# EAGLE design DOT-TEMPLATE (EAGLE 7.2.0)
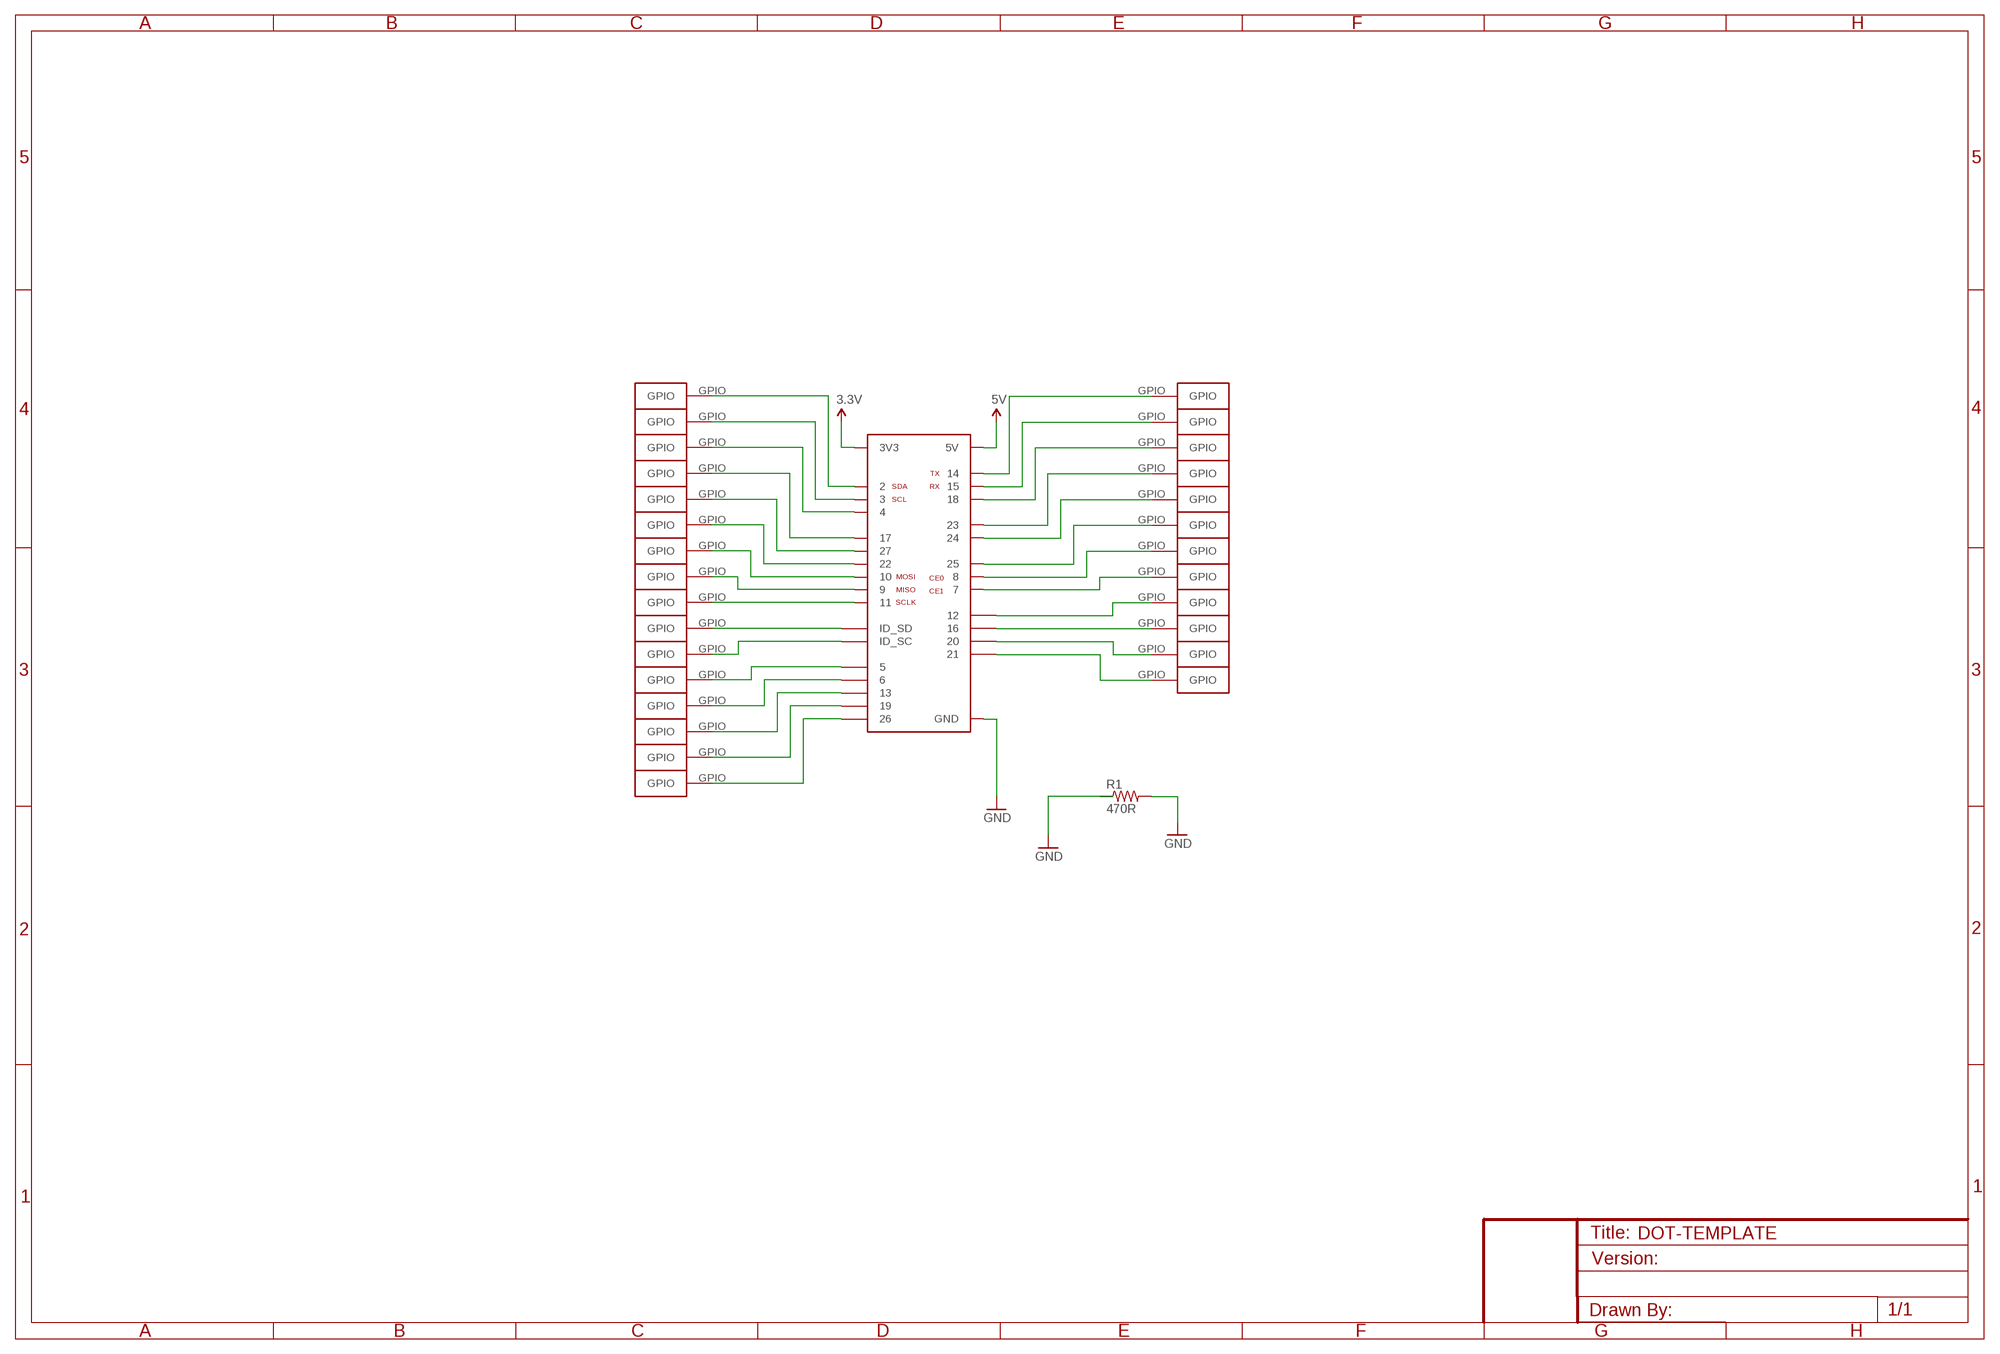
[diagram p0: schematic, sheet 1]

## Parts
AIR  DOT  [DOTPAD]
AIR1  DOT  [DOTPAD]
AIR2  DOT  [DOTPAD]
AIR3  DOT  [DOTPAD]
AIR4  DOT  [DOTPAD]
AIR5  DOT  [DOTPAD]
AIR6  DOT  [DOTPAD]
AIR7  DOT  [DOTPAD]
AIR8  DOT  [DOTPAD]
AIR9  DOT  [DOTPAD]
AIR10  DOT  [DOTPAD]
AIR11  DOT  [DOTPAD]
AIR12  DOT  [DOTPAD]
AIR13  DOT  [DOTPAD]
AIR14  DOT  [DOTPAD]
AIR15  DOT  [DOTPAD]
AIR16  DOT  [DOTPAD]
AIR17  DOT  [DOTPAD]
AIR18  DOT  [DOTPAD]
AIR19  DOT  [DOTPAD]
AIR20  DOT  [DOTPAD]
AIR21  DOT  [DOTPAD]
AIR22  DOT  [DOTPAD]
AIR23  DOT  [DOTPAD]
AIR24  DOT  [DOTPAD]
AIR25  DOT  [DOTPAD]
AIR26  DOT  [DOTPAD]
AIR27  DOT  [DOTPAD]
R1  470R  RESISTOR0603-RES  [0603-RES]
U$1  RPIGPIOPINHD-2X20-SMD-FLIPPED  [FCI_89898_313LF_40P_CONNECTOR_SMT_FLIPPED]

## Nets
3.3V: U$1.P1_3V3(3V3) U$1.P17_3V3(3V3)
5V: U$1.P2_5V(5V) U$1.P4_5V(5V)
GND: R1.2 U$1.P6_GND(GND) U$1.P9_GND(GND) U$1.P14_GND(GND) U$1.P20_GND(GND) U$1.P25_GND(GND) U$1.P30_GND(GND) U$1.P34_GND(GND) U$1.P39_GND(GND)
N$1: AIR10.GPIO U$1.P3_GPIO2_SDA
N$2: AIR9.GPIO U$1.P5_GPIO3_SCL
N$4: AIR.GPIO U$1.P7_GPIO4
N$5: AIR1.GPIO U$1.P11_GPIO17
N$6: AIR2.GPIO U$1.P13_GPIO27
N$7: AIR3.GPIO U$1.P15_GPIO22
N$8: AIR4.GPIO U$1.P19_GPIO10_SPI0_MOSI
N$9: AIR5.GPIO U$1.P21_GPIO9_SPI0_MISO
N$10: AIR6.GPIO U$1.P23_GPIO11_SPI0_SCLK
N$11: AIR7.GPIO U$1.P27_IDSD(ID_SD)
N$12: AIR8.GPIO U$1.P28_IDSC(ID_SC)
N$13: AIR11.GPIO U$1.P29_GPIO5
N$14: AIR12.GPIO U$1.P31_GPIO6
N$15: AIR13.GPIO U$1.P33_GPIO13
N$16: AIR14.GPIO U$1.P35_GPIO19
N$17: AIR18.GPIO U$1.P8_GPIO14_UART0_TXD
N$18: AIR15.GPIO U$1.P37_GPIO26
N$19: AIR16.GPIO U$1.P10_GPIO15_UART0_RXD
N$20: AIR17.GPIO U$1.P12_GPIO18
N$21: AIR19.GPIO U$1.P16_GPIO23
N$22: AIR20.GPIO U$1.P18_GPIO24
N$23: AIR21.GPIO U$1.P22_GPIO25
N$24: AIR22.GPIO U$1.P24_GPIO8_SPI0_CE0
N$25: AIR23.GPIO U$1.P26_GPIO7_SPI0_CE1
N$26: AIR24.GPIO U$1.P32_GPIO12
N$27: AIR25.GPIO U$1.P36_GPIO16
N$28: AIR26.GPIO U$1.P38_GPIO20
N$29: AIR27.GPIO U$1.P40_GPIO21
Unconnected: R1.1

## Library data of the parts
AIR AIR1-AIR27 = rzrzr:DOT
R1 = SparkFun-Passives:RESISTOR: Resistor Basic schematic elements and footprints for 0603, 1206, and PTH resistors.
U$1 = pimoroni:RPIGPIOPINHD-2X20-SMD-FLIPPED

## Net classes
0 default: width 0.152 mm, drill 0.5 mm, clearance 0.152 mm

## Board
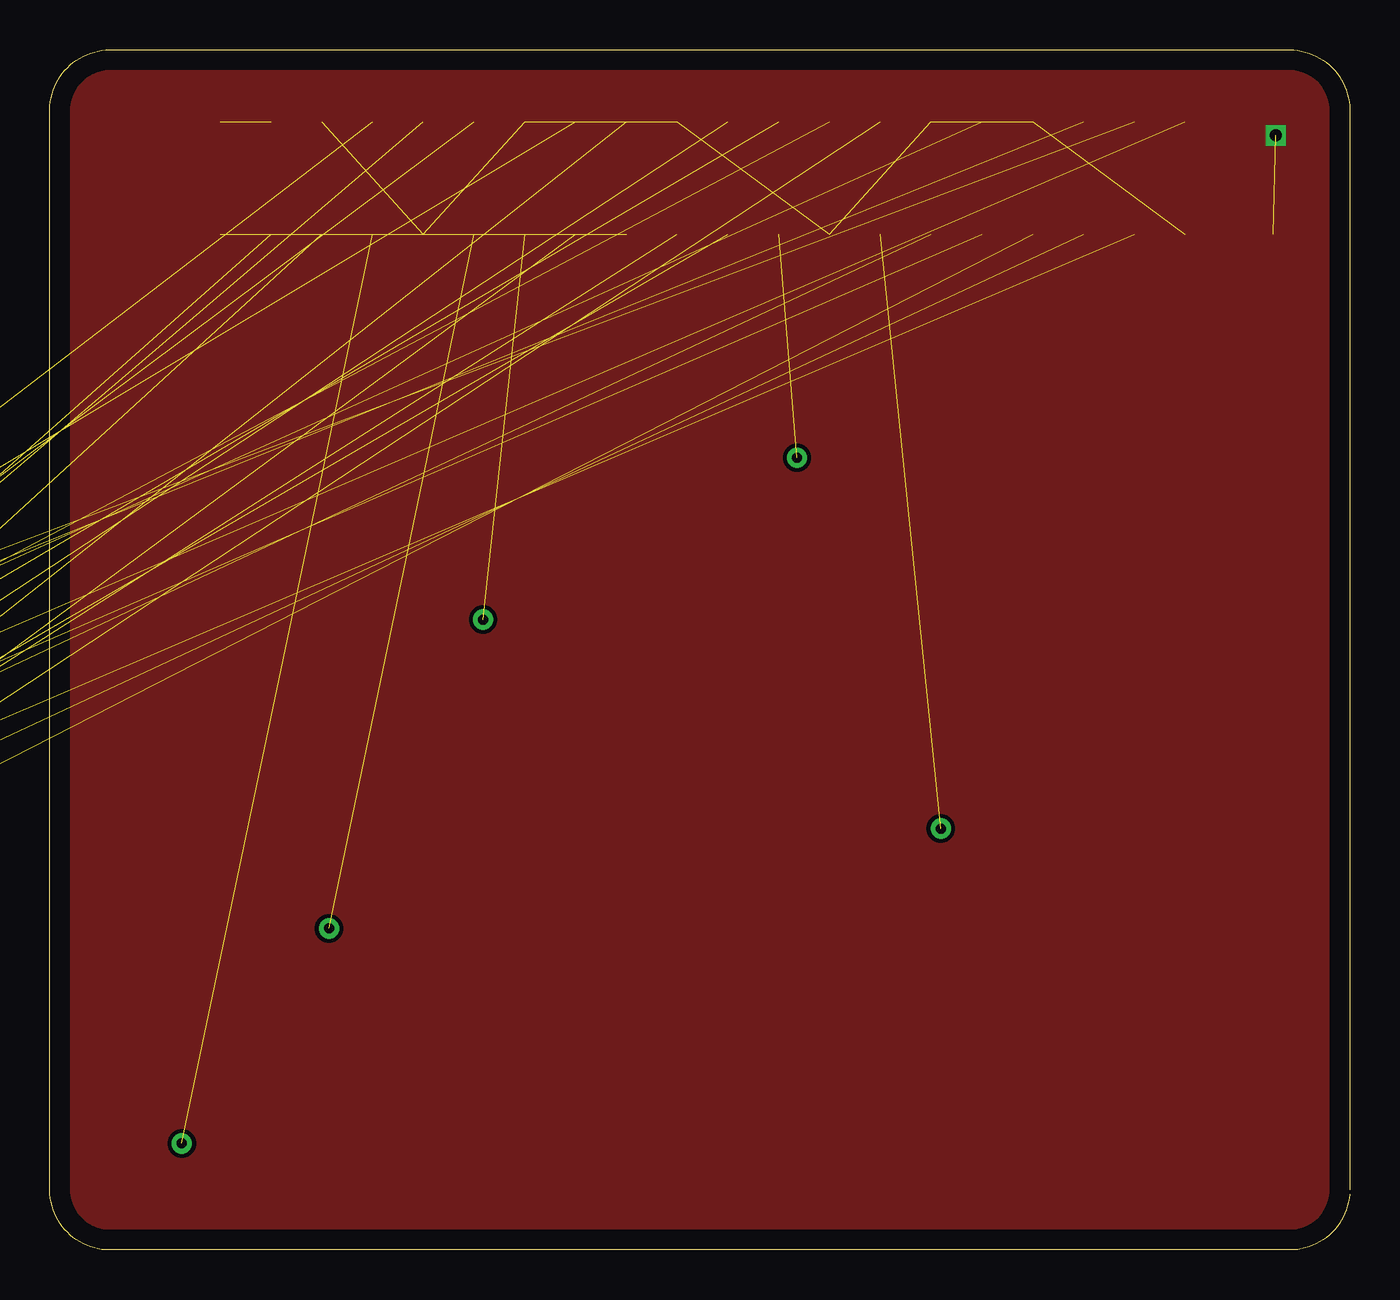
[diagram p1: board, top side]
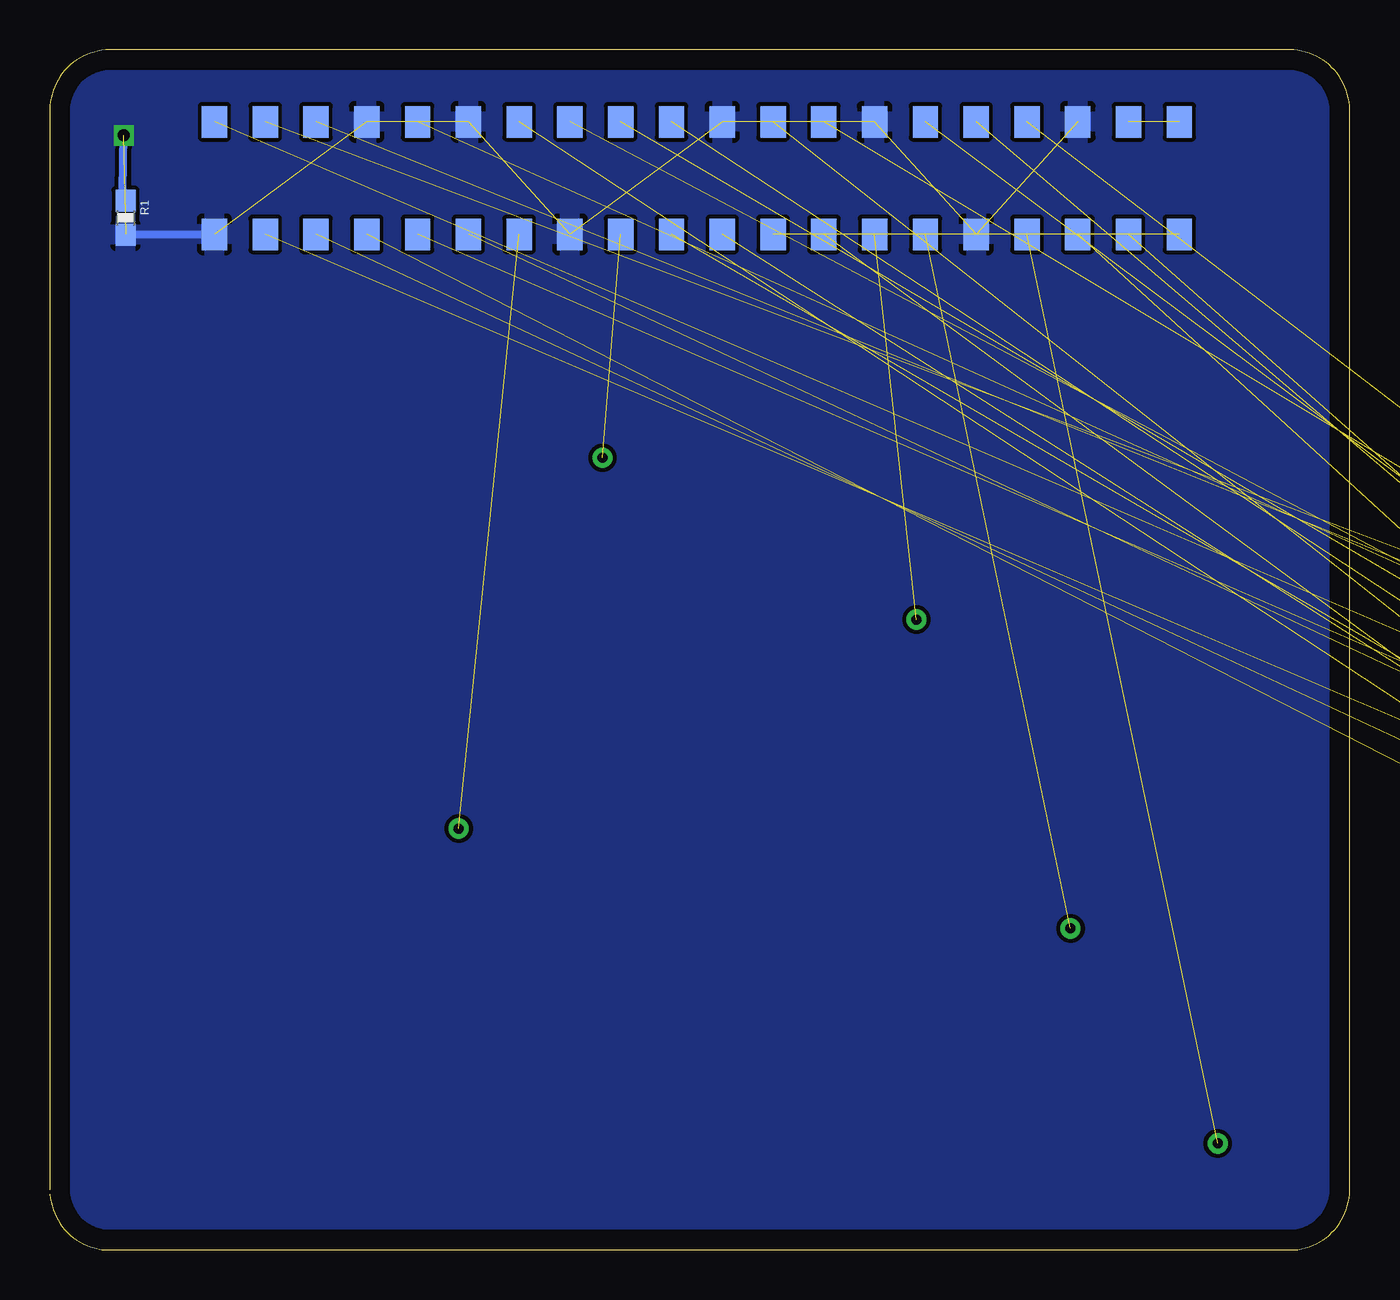
[diagram p2: board, bottom side, seen from below]

Size 65 x 60 mm. Coordinates in mm from the lower left corner, seen from the top.
Outline: 65,2.79 64.98,2.59 64.94,2.4 64.9,2.2 64.84,2.01 64.76,1.83 64.69,1.65 64.6,1.48 64.49,1.32 64.38,1.16 64.26,1.01 63.99,0.74 63.84,0.62 63.68,0.51 63.52,0.4 63.35,0.31 63.17,0.24 62.99,0.16 62.8,0.1 62.41,0.02 62.21,0 2.79,0 2.59,0.02 2.4,0.06 2.2,0.1 2.01,0.16 1.83,0.24 1.65,0.31 1.48,0.4 1.32,0.51 1.16,0.62 1.01,0.74 0.88,0.88 0.74,1.01 0.62,1.16 0.51,1.32 0.4,1.48 0.31,1.65 0.24,1.83 0.16,2.01 0.1,2.2 0.06,2.4 0.02,2.59 0,2.79 0,57.21 0.02,57.41 0.06,57.6 0.1,57.8 0.16,57.99 0.24,58.17 0.31,58.35 0.4,58.52 0.51,58.68 0.62,58.84 0.74,58.99 0.88,59.12 1.01,59.26 1.16,59.38 1.32,59.49 1.48,59.6 1.65,59.69 1.83,59.76 2.01,59.84 2.2,59.9 2.4,59.94 2.59,59.98 2.79,60 62.21,60 62.41,59.98 62.6,59.94 62.8,59.9 62.99,59.84 63.17,59.76 63.35,59.69 63.52,59.6 63.68,59.49 63.84,59.38 63.99,59.26 64.26,58.99 64.38,58.84 64.49,58.68 64.6,58.52 64.69,58.35 64.76,58.17 64.84,57.99 64.9,57.8 64.94,57.6 64.98,57.41 65,57.21 65,3
Copper layers (1*16): Top 0.035mm / dielectric 1.5mm / Bottom 0.035mm
Design rules "default": minimum track width 10mil, minimum drill 24mil, track to track 8mil, track to pad 8mil, pad to pad 8mil, via to via 8mil, smd to smd 8mil, copper to edge 40mil, drill to drill 8mil, minimum pad ring 10mil, minimum via ring 8mil, stop-mask expansion 4mil, vias tented up to drill 0mil, thermal gap 10mil

### Footprints (pad centres in the part's own frame; a part is rotated, then mirrored left to right if it is on the bottom)
DOTPAD = drill 0.5: GPIO 0,0
0603-RES = smd 1.1 x 1: 1 -0.85,0; 2 0.85,0
FCI_89898_313LF_40P_CONNECTOR_SMT_FLIPPED = smd 1.27 x 1.57: P1_3V3 24.13,-2.81; P2_5V 24.13,2.81; P3_GPIO2_SDA 21.59,-2.81; P4_5V 21.59,2.81; P5_GPIO3_SCL 19.05,-2.81; P6_GND 19.05,2.81; P7_GPIO4 16.51,-2.81; P8_GPIO14_UART0_TXD 16.51,2.81; P9_GND 13.97,-2.81; P10_GPIO15_UART0_RXD 13.97,2.81; P11_GPIO17 11.43,-2.81; P12_GPIO18 11.43,2.81; P13_GPIO27 8.89,-2.81; P14_GND 8.89,2.81; P15_GPIO22 6.35,-2.81; P16_GPIO23 6.35,2.81; P17_3V3 3.81,-2.81; P18_GPIO24 3.81,2.81; P19_GPIO10_SPI0_MOSI 1.27,-2.81; P20_GND 1.27,2.81; P21_GPIO9_SPI0_MISO -1.27,-2.81; P22_GPIO25 -1.27,2.81; P23_GPIO11_SPI0_SCLK -3.81,-2.81; P24_GPIO8_SPI0_CE0 -3.81,2.81; P25_GND -6.35,-2.81; P26_GPIO7_SPI0_CE1 -6.35,2.81; P27_IDSD -8.89,-2.81; P28_IDSC -8.89,2.81; P29_GPIO5 -11.43,-2.81; P30_GND -11.43,2.81; P31_GPIO6 -13.97,-2.81; P32_GPIO12 -13.97,2.81; P33_GPIO13 -16.51,-2.81; P34_GND -16.51,2.81; P35_GPIO19 -19.05,-2.81; P36_GPIO16 -19.05,2.81; P37_GPIO26 -21.59,-2.81; P38_GPIO20 -21.59,2.81; P39_GND -24.13,-2.81; P40_GPIO21 -24.13,2.81

### Placement (x,y rotation side)
AIR  6.6,5.33 0 top
AIR1  13.96,16.08 0 top
AIR2  21.66,31.52 0 top
AIR3  -30.48,8.93 0 top  (outside the outline)
AIR4  -34.29,8.93 0 top  (outside the outline)
AIR5  -38.1,8.93 0 top  (outside the outline)
AIR6  37.36,39.61 0 top
AIR7  44.55,21.07 0 top
AIR8  -22.86,14.01 0 top  (outside the outline)
AIR9  -26.67,14.01 0 top  (outside the outline)
AIR10  -30.48,14.01 0 top  (outside the outline)
AIR11  -34.29,14.01 0 top  (outside the outline)
AIR12  -38.1,14.01 0 top  (outside the outline)
AIR13  -15.24,17.82 0 top  (outside the outline)
AIR14  -19.05,17.82 0 top  (outside the outline)
AIR15  -22.86,17.82 0 top  (outside the outline)
AIR16  -26.67,17.82 0 top  (outside the outline)
AIR17  -30.48,17.82 0 top  (outside the outline)
AIR18  -34.29,17.82 0 top  (outside the outline)
AIR19  -38.1,17.82 0 top  (outside the outline)
AIR20  -15.24,21.63 0 top  (outside the outline)
AIR21  -19.05,21.63 0 top  (outside the outline)
AIR22  -22.86,21.63 0 top  (outside the outline)
AIR23  -26.67,21.63 0 top  (outside the outline)
AIR24  -30.48,21.63 0 top  (outside the outline)
AIR25  -34.29,21.63 0 top  (outside the outline)
AIR26  -38.1,21.63 0 top  (outside the outline)
AIR27  -15.24,25.44 0 top  (outside the outline)
R1  61.22,51.61 270 bottom
U$1  32.64,53.59 0 bottom

### Tracks (layer width: path | path; a pad name or v marks a point on that pad's centre or on a via)
3.3V  (1 unrouted)
5V  (1 unrouted)
GND  (via drill 0.6)  (8 unrouted)
  Bottom 0.406: R1.2 61.19,50.78 U$1.P39_GND
  other vias: 61.32,55.73
  pour Top: -1.27,59.83 65.81,59.83 65.81,-0.22 -1.27,-0.22
  pour Bottom: 0.89,60.25 66.06,60.25 66.06,0.04 0.89,0.04
N$1  (1 unrouted)
N$2  (1 unrouted)
N$4  (1 unrouted)
N$5  (1 unrouted)
N$6  (1 unrouted)
N$7  (1 unrouted)
N$8  (1 unrouted)
N$9  (1 unrouted)
N$10  (1 unrouted)
N$11  (1 unrouted)
N$12  (1 unrouted)
N$13  (1 unrouted)
N$14  (1 unrouted)
N$15  (1 unrouted)
N$16  (1 unrouted)
N$17  (1 unrouted)
N$18  (1 unrouted)
N$19  (1 unrouted)
N$20  (1 unrouted)
N$21  (1 unrouted)
N$22  (1 unrouted)
N$23  (1 unrouted)
N$24  (1 unrouted)
N$25  (1 unrouted)
N$26  (1 unrouted)
N$27  (1 unrouted)
N$28  (1 unrouted)
N$29  (1 unrouted)
N$30
  Bottom 0.406: 61.4,52.72 61.36,52.98 61.32,55.77